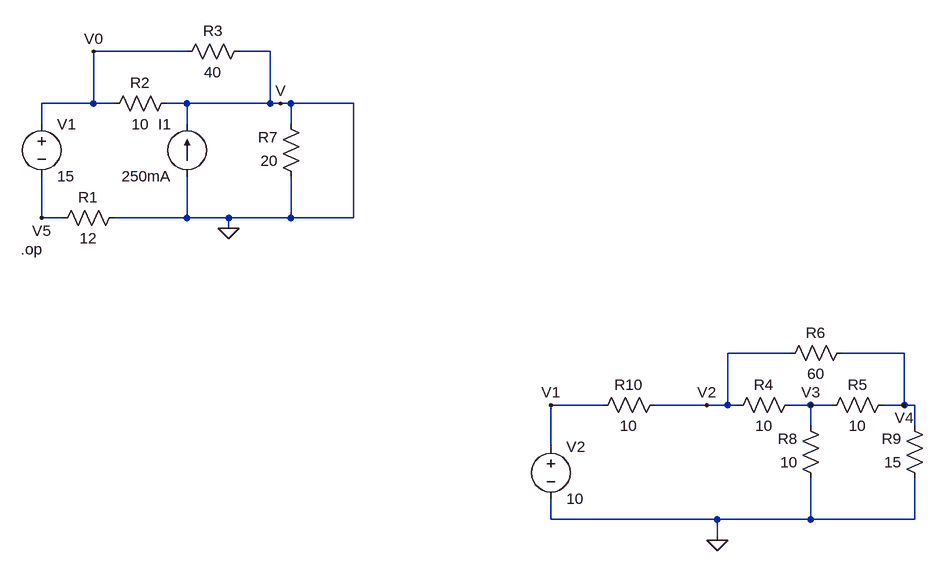
[diagram p0: schematic ThevininEquivalent.asc]
ThevininEquivalent.asc, the LTspice schematic file:
Version 4
SHEET 1 932 680
WIRE -208 -1056 -352 -1056
WIRE -80 -1056 -128 -1056
WIRE -352 -976 -352 -1056
WIRE -352 -976 -432 -976
WIRE -320 -976 -352 -976
WIRE -208 -976 -240 -976
WIRE -80 -976 -80 -1056
WIRE -80 -976 -208 -976
WIRE -64 -976 -80 -976
WIRE -48 -976 -64 -976
WIRE 48 -976 -48 -976
WIRE -432 -944 -432 -976
WIRE -208 -944 -208 -976
WIRE -48 -944 -48 -976
WIRE -432 -800 -432 -864
WIRE -400 -800 -432 -800
WIRE -208 -800 -208 -864
WIRE -208 -800 -320 -800
WIRE -144 -800 -208 -800
WIRE -48 -800 -48 -864
WIRE -48 -800 -144 -800
WIRE 48 -800 48 -976
WIRE 48 -800 -48 -800
WIRE -144 -784 -144 -800
WIRE 720 -592 624 -592
WIRE 896 -592 800 -592
WIRE 432 -512 352 -512
WIRE 592 -512 512 -512
WIRE 624 -512 624 -592
WIRE 624 -512 592 -512
WIRE 640 -512 624 -512
WIRE 752 -512 720 -512
WIRE 784 -512 752 -512
WIRE 896 -512 896 -592
WIRE 896 -512 864 -512
WIRE 912 -512 896 -512
WIRE 752 -480 752 -512
WIRE 912 -480 912 -512
WIRE 352 -448 352 -512
WIRE 352 -336 352 -368
WIRE 608 -336 352 -336
WIRE 752 -336 752 -400
WIRE 752 -336 608 -336
WIRE 912 -336 912 -400
WIRE 912 -336 752 -336
WIRE 608 -304 608 -336
FLAG 608 -304 0
FLAG -352 -1056 V0
FLAG -64 -976 V
FLAG 752 -512 V3
FLAG 896 -512 V4
FLAG -432 -800 V5
FLAG -144 -784 0
FLAG 592 -512 V2
FLAG 352 -512 V1
SYMBOL voltage -432 -960 R0
WINDOW 123 0 0 Left 0
WINDOW 39 0 0 Left 0
SYMATTR InstName V1
SYMATTR Value 15
SYMBOL current -208 -864 R180
WINDOW 0 24 80 Left 2
WINDOW 3 24 0 Left 2
WINDOW 123 0 0 Left 0
WINDOW 39 0 0 Left 0
SYMATTR InstName I1
SYMATTR Value 250mA
SYMBOL res -304 -816 R90
WINDOW 0 0 56 VBottom 2
WINDOW 3 32 56 VTop 2
SYMATTR InstName R1
SYMATTR Value 12
SYMBOL res -224 -992 R90
WINDOW 0 0 56 VBottom 2
WINDOW 3 32 56 VTop 2
SYMATTR InstName R2
SYMATTR Value 10
SYMBOL res -112 -1072 R90
WINDOW 0 0 56 VBottom 2
WINDOW 3 32 56 VTop 2
SYMATTR InstName R3
SYMATTR Value 40
SYMBOL res 736 -528 R90
WINDOW 0 0 56 VBottom 2
WINDOW 3 32 56 VTop 2
SYMATTR InstName R4
SYMATTR Value 10
SYMBOL res 880 -528 R90
WINDOW 0 0 56 VBottom 2
WINDOW 3 32 56 VTop 2
SYMATTR InstName R5
SYMATTR Value 10
SYMBOL res 816 -608 R90
WINDOW 0 0 56 VBottom 2
WINDOW 3 32 56 VTop 2
SYMATTR InstName R6
SYMATTR Value 60
SYMBOL res -32 -848 R180
WINDOW 0 36 76 Left 2
WINDOW 3 36 40 Left 2
SYMATTR InstName R7
SYMATTR Value 20
SYMBOL res 768 -384 R180
WINDOW 0 36 76 Left 2
WINDOW 3 36 40 Left 2
SYMATTR InstName R8
SYMATTR Value 10
SYMBOL res 928 -384 R180
WINDOW 0 36 76 Left 2
WINDOW 3 36 40 Left 2
SYMATTR InstName R9
SYMATTR Value 15
SYMBOL res 528 -528 R90
WINDOW 0 0 56 VBottom 2
WINDOW 3 32 56 VTop 2
SYMATTR InstName R10
SYMATTR Value 10
SYMBOL voltage 352 -464 R0
WINDOW 123 0 0 Left 0
WINDOW 39 0 0 Left 0
SYMATTR InstName V2
SYMATTR Value 10
TEXT -464 -752 Left 2 !.op

The netlist it stands for:
* ThevininEquivalent.asc
V1 V0 V5 15
I1 0 0 250mA
R1 0 V5 12
R2 0 V0 10
R3 0 V0 40
R4 V3 V2 10
R5 V4 V3 10
R6 V4 V2 60
R7 0 0 20
R8 0 V3 10
R9 0 V4 15
R10 V2 V1 10
V2 V1 0 10
.op
.backanno
.end